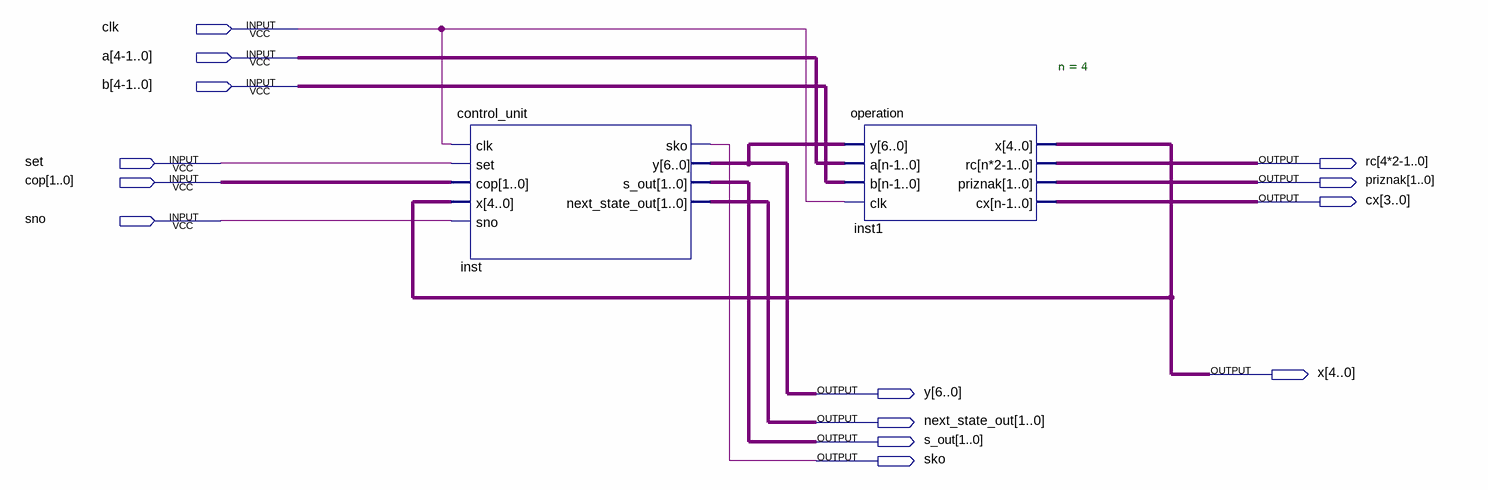
[diagram p0: schematic sheet]
// Quartus schematic alu.bdf as structural Verilog: 2 symbols, 14 pins
module alu (
  input  clk,
  input  \a[4-1..0] ,
  input  \b[4-1..0] ,
  input  set,
  input  [1:0] cop,
  input  sno,
  output \rc[4*2-1..0] ,
  output [1:0] priznak,
  output [3:0] cx,
  output [4:0] x,
  output [6:0] y,
  output [1:0] next_state_out,
  output [1:0] s_out,
  output sko
);

  wire [3:0] undriven, undriven_2;
  wire [7:0] inst1_rc;

  control_unit inst (
    .clk(clk), .set(set), .cop(cop), .x(x), .sno(sno), .sko(sko), .y(y), .s_out(s_out),
    .next_state_out(next_state_out));
  operation #(.n(4)) inst1 (
    .y(y), .a(undriven), .b(undriven_2), .clk(clk), .x(x), .rc(inst1_rc), .priznak(priznak), .cx(cx));
endmodule
